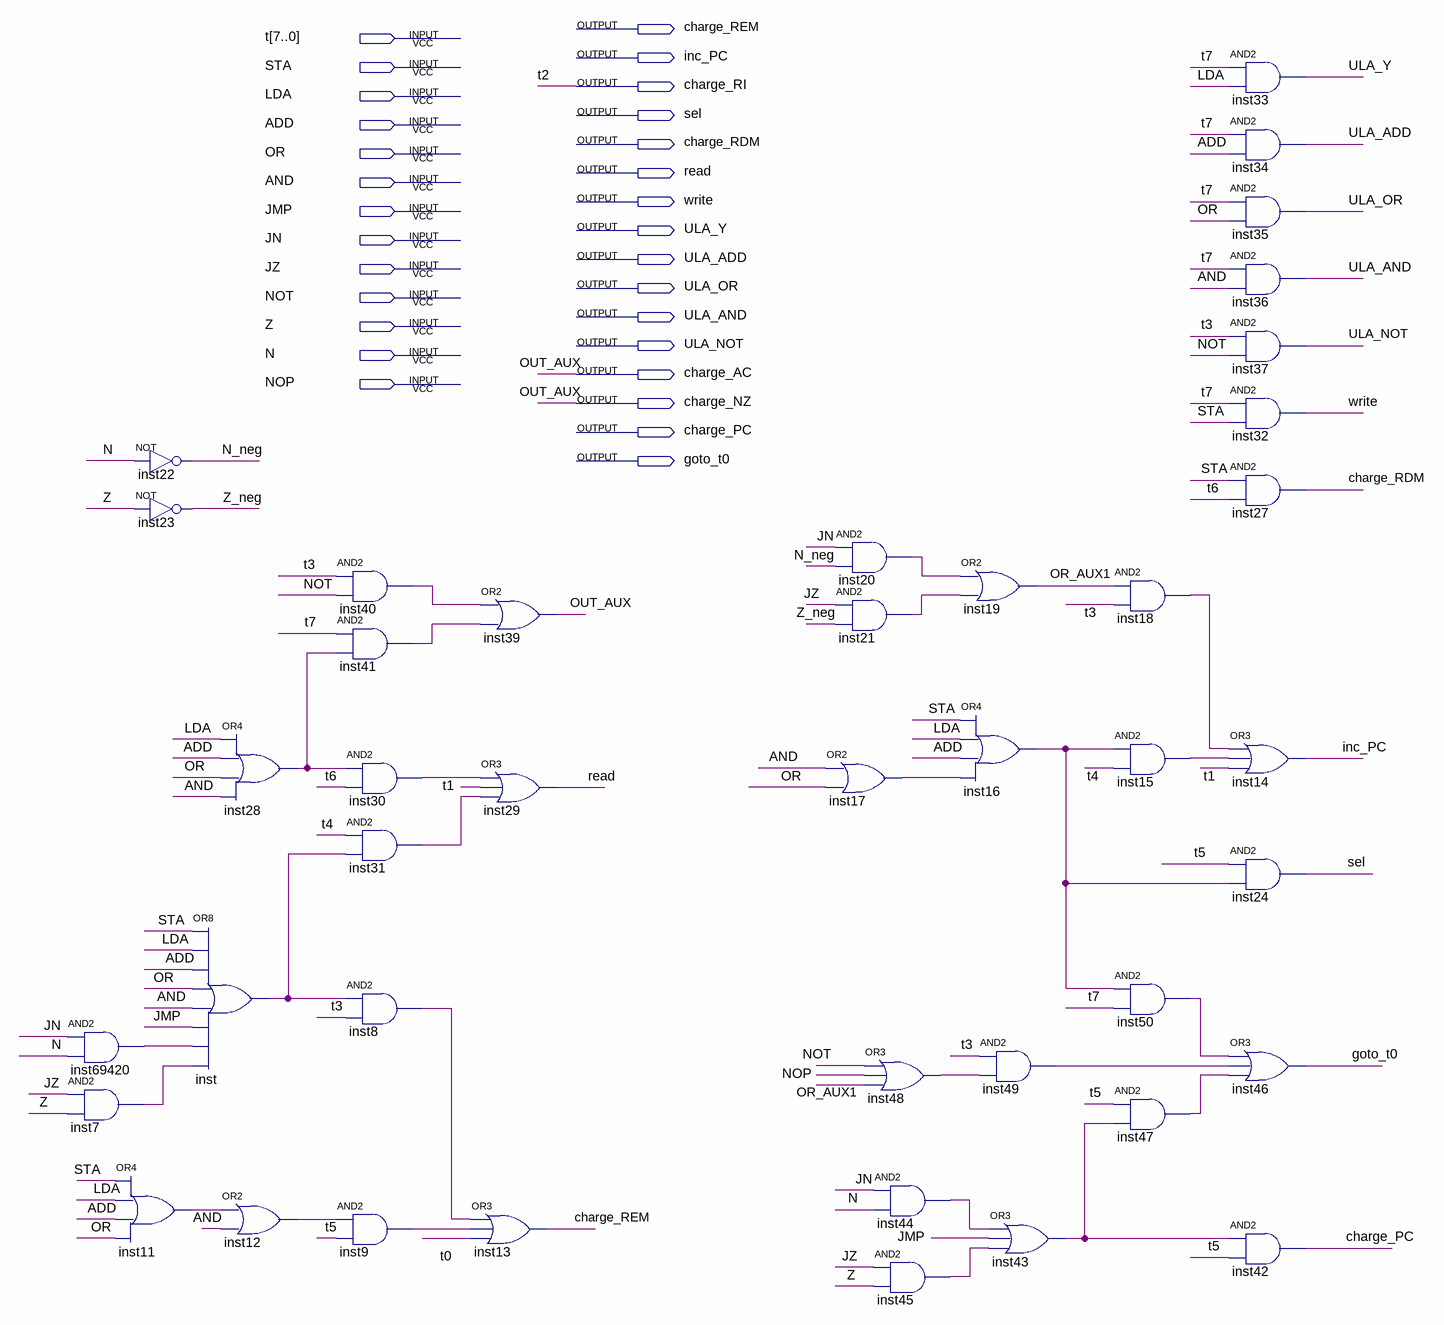
[diagram p0: schematic sheet]
// Quartus schematic UC.bdf as structural Verilog: 42 symbols, 29 pins
module UC (
  input  [7:0] t,
  input  STA,
  input  LDA,
  input  ADD,
  input  OR,
  input  AND,
  input  JMP,
  input  JN,
  input  JZ,
  input  NOT,
  input  Z,
  input  N,
  input  NOP,
  output charge_REM,
  output inc_PC,
  output charge_RI,
  output sel,
  output charge_RDM,
  output read,
  output write,
  output ULA_Y,
  output ULA_ADD,
  output ULA_OR,
  output ULA_AND,
  output ULA_NOT,
  output charge_AC,
  output charge_NZ,
  output charge_PC,
  output goto_t0
);

  wire inst7_out, inst8_out, inst9_out, inst11_out, inst12_out, inst15_out, inst16_out, inst17_out,
       inst18_out, inst20_out, inst21_out, inst28_out, inst30_out, inst31_out, inst40_out, inst41_out,
       inst43_out, inst44_out, inst45_out, inst47_out, inst48_out, inst49_out, inst50_out, inst69420_out,
       inst_out, N_neg, OR_AUX1, Z_neg;

  not inst22 (N_neg, N);
  not inst23 (Z_neg, Z);
  and inst69420 (inst69420_out, JN, N);
  and inst7 (inst7_out, JZ, Z);
  or inst11 (inst11_out, STA, LDA, ADD, OR);
  or inst (inst_out, STA, LDA, ADD, OR, AND, JMP, inst69420_out, inst7_out);
  or inst28 (inst28_out, LDA, ADD, OR, AND);
  or inst12 (inst12_out, inst11_out, AND);
  and inst40 (inst40_out, t[3], NOT);
  and inst41 (inst41_out, t[7], inst28_out);
  and inst30 (inst30_out, inst28_out, t[6]);
  and inst31 (inst31_out, t[4], inst_out);
  and inst8 (inst8_out, inst_out, t[3]);
  and inst9 (inst9_out, inst12_out, t[5]);
  or inst39 (charge_AC, inst40_out, inst41_out);
  or inst29 (read, inst30_out, t[1], inst31_out);
  or inst13 (charge_REM, inst8_out, inst9_out, t[0]);
  or inst17 (inst17_out, AND, OR);
  and inst20 (inst20_out, JN, N_neg);
  and inst21 (inst21_out, JZ, Z_neg);
  or inst48 (inst48_out, NOT, NOP, OR_AUX1);
  and inst44 (inst44_out, JN, N);
  and inst45 (inst45_out, JZ, Z);
  or inst19 (OR_AUX1, inst20_out, inst21_out);
  or inst16 (inst16_out, STA, LDA, ADD, inst17_out);
  and inst49 (inst49_out, t[3], inst48_out);
  or inst43 (inst43_out, inst44_out, JMP, inst45_out);
  and inst18 (inst18_out, OR_AUX1, t[3]);
  and inst15 (inst15_out, inst16_out, t[4]);
  and inst50 (inst50_out, inst16_out, t[7]);
  and inst47 (inst47_out, t[5], inst43_out);
  and inst33 (ULA_Y, t[7], LDA);
  and inst34 (ULA_ADD, t[7], ADD);
  and inst35 (ULA_OR, t[7], OR);
  and inst36 (ULA_AND, t[7], AND);
  and inst37 (ULA_NOT, t[3], NOT);
  and inst32 (write, t[7], STA);
  and inst27 (charge_RDM, STA, t[6]);
  or inst14 (inc_PC, inst18_out, inst15_out, t[1]);
  and inst24 (sel, t[5], inst16_out);
  or inst46 (goto_t0, inst50_out, inst49_out, inst47_out);
  and inst42 (charge_PC, inst43_out, t[5]);

  assign charge_NZ = charge_AC;
  assign charge_RI = t[2];

  // Other names for the same wires on the sheet: OUT_AUX = charge_AC
endmodule
